# Altium schematic sheet MyProSch5.SchDoc: Bridge USB IDCI
size A4; Revision: R00